# EAGLE design EXM Relay Four - Rev A1 (EAGLE 7.7.0)
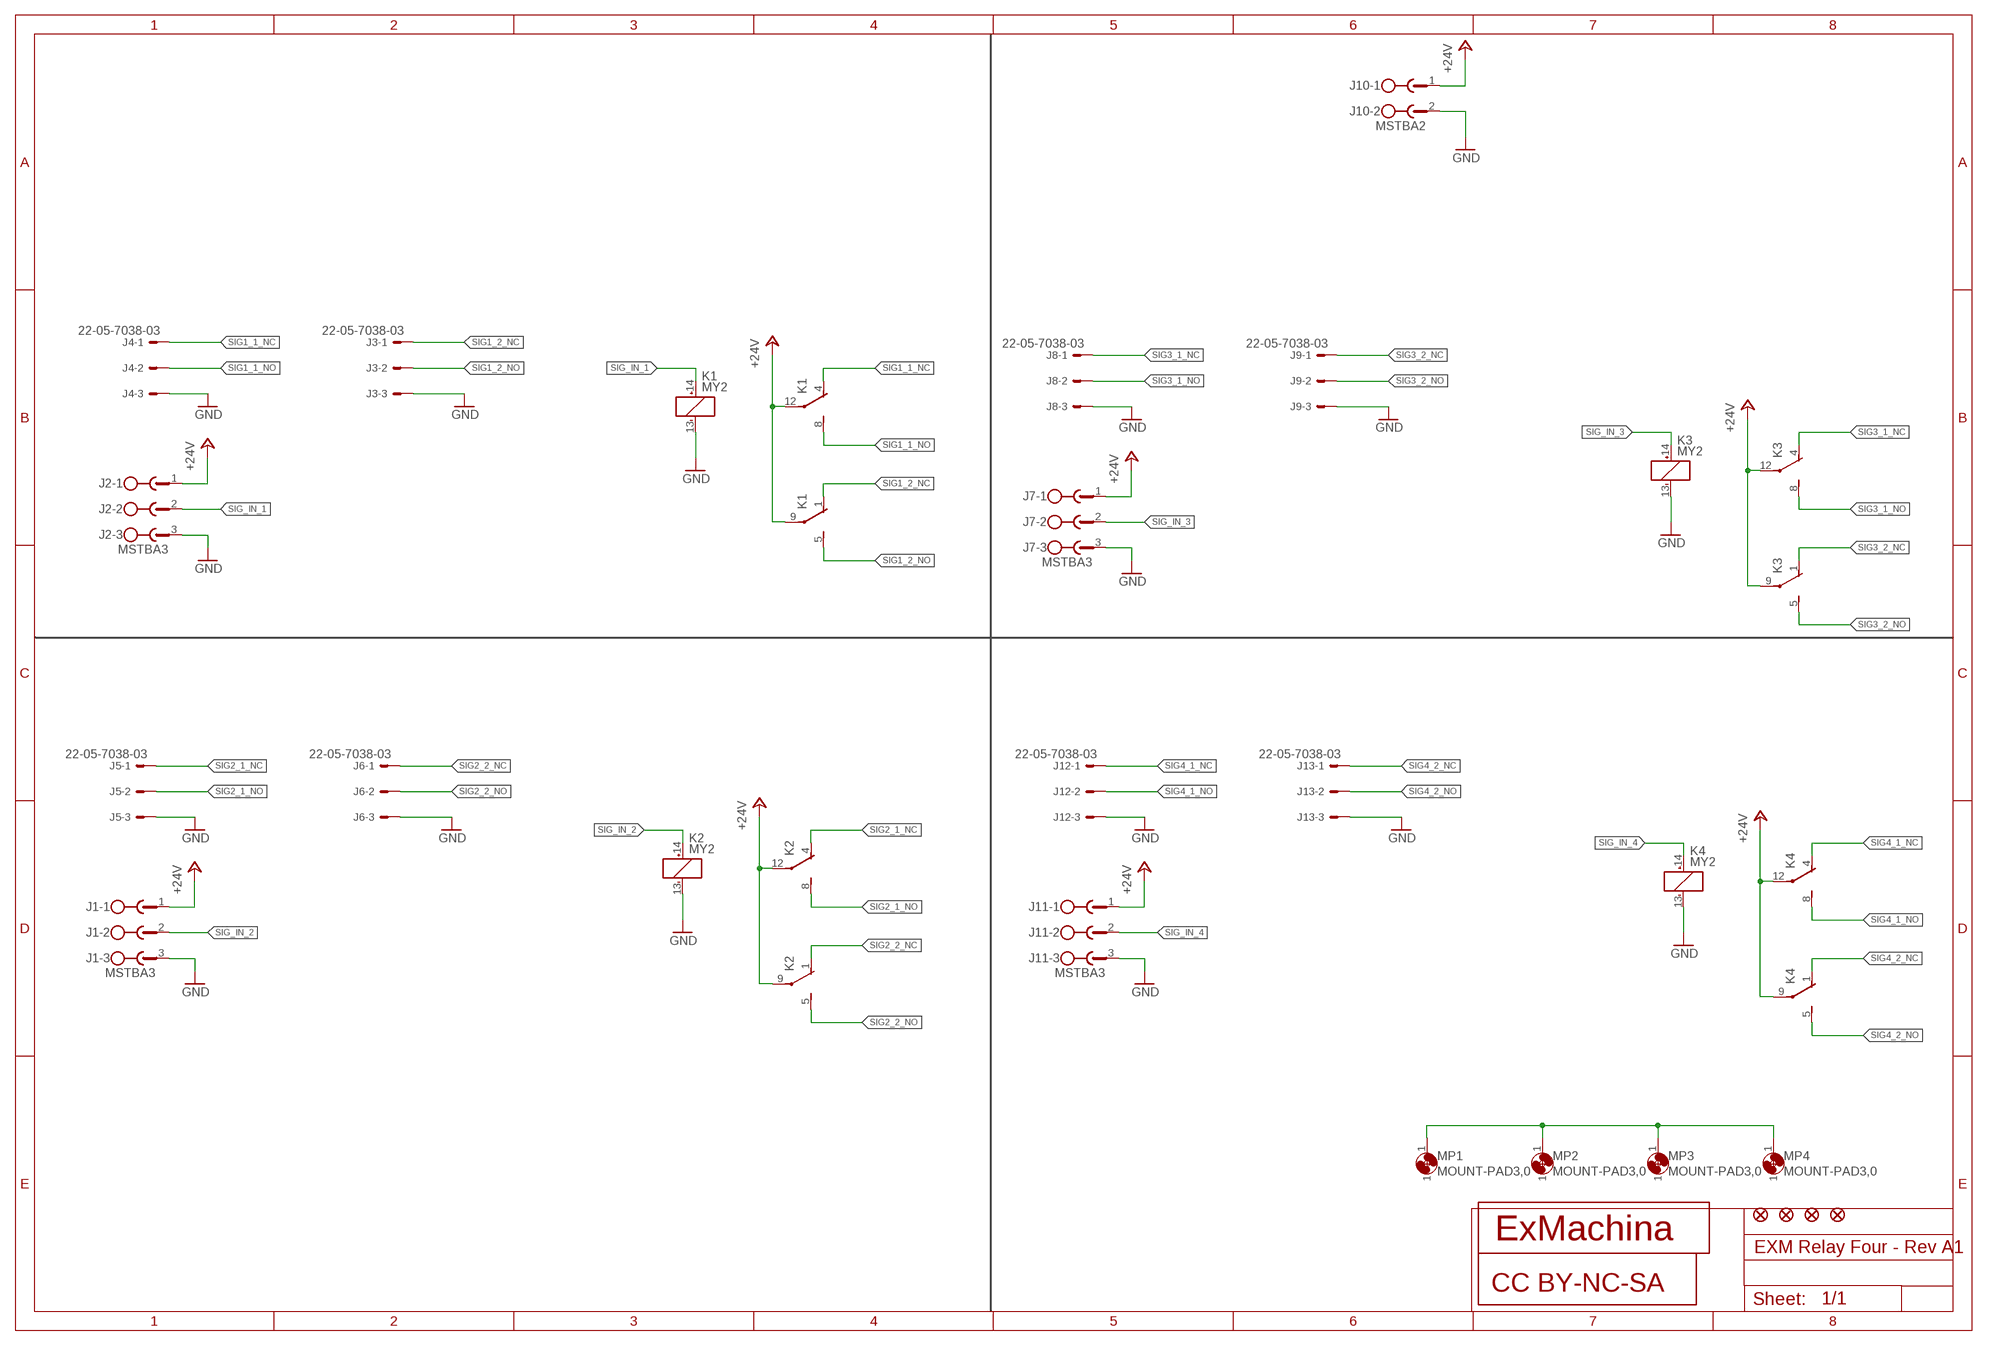
[diagram p0: schematic, sheet 1]

## Parts
CC1  CC-BY-NC-SA  [CC-BY-NC-SA]
J1  MSTBA3  [MSTBA3]
J2  MSTBA3  [MSTBA3]
J3  22-05-7038-03  [7395-03]
J4  22-05-7038-03  [7395-03]
J5  22-05-7038-03  [7395-03]
J6  22-05-7038-03  [7395-03]
J7  MSTBA3  [MSTBA3]
J8  22-05-7038-03  [7395-03]
J9  22-05-7038-03  [7395-03]
J10  MSTBA2  [MSTBA2]
J11  MSTBA3  [MSTBA3]
J12  22-05-7038-03  [7395-03]
J13  22-05-7038-03  [7395-03]
JP1  FIDUCIAL1X2  [FIDUCIAL-1X2]
JP2  FIDUCIAL1X2  [FIDUCIAL-1X2]
JP3  FIDUCIAL1X2  [FIDUCIAL-1X2]
JP4  FIDUCIAL1X2  [FIDUCIAL-1X2]
K1  MY2  [PY08]
K2  MY2  [PY08]
K3  MY2  [PY08]
K4  MY2  [PY08]
MP1  MOUNT-PAD3,0  [P3,0]
MP2  MOUNT-PAD3,0  [P3,0]
MP3  MOUNT-PAD3,0  [P3,0]
MP4  MOUNT-PAD3,0  [P3,0]
T1  EXMACHINA-LOGO-NAME  [EXM-LOGO-BASELINE]

## Nets
1: MP1.1 MP2.1 MP3.1 MP4.1
+24V: J1.1 J2.1 J7.1 J10.1 J11.1 K1.9(C) K1.12(C) K2.9(C) K2.12(C) K3.9(C) K3.12(C) K4.9(C) K4.12(C)
GND: J1.3 J2.3 J3.3 J4.3 J5.3 J6.3 J7.3 J8.3 J9.3 J10.2 J11.3 J12.3 J13.3 K1.13(-) K2.13(-) K3.13(-) K4.13(-)
SIG1_1_NC: J4.1 K1.4(NC)
SIG1_1_NO: J4.2 K1.8(NO)
SIG1_2_NC: J3.1 K1.1(NC)
SIG1_2_NO: J3.2 K1.5(NO)
SIG2_1_NC: J5.1 K2.4(NC)
SIG2_1_NO: J5.2 K2.8(NO)
SIG2_2_NC: J6.1 K2.1(NC)
SIG2_2_NO: J6.2 K2.5(NO)
SIG3_1_NC: J8.1 K3.4(NC)
SIG3_1_NO: J8.2 K3.8(NO)
SIG3_2_NC: J9.1 K3.1(NC)
SIG3_2_NO: J9.2 K3.5(NO)
SIG4_1_NC: J12.1 K4.4(NC)
SIG4_1_NO: J12.2 K4.8(NO)
SIG4_2_NC: J13.1 K4.1(NC)
SIG4_2_NO: J13.2 K4.5(NO)
SIG_IN_1: J2.2 K1.14(+)
SIG_IN_2: J1.2 K2.14(+)
SIG_IN_3: J7.2 K3.14(+)
SIG_IN_4: J11.2 K4.14(+)

## Library data of the parts
CC1 = cc-by-sa:CC-BY-NC-SA
J1 J2 J7 J11 = con-phoenix-508:MSTBA3: PHOENIX; MF: FARNELL; MPN: 1757255; OC_FARNELL: 3705183; OC_NEWARK: 71C4162
J3-J6 J8 J9 J12 J13 = con-molex:22-?-03: CONNECTOR wire to board 2.54 mm (.1 inch) pitch header; OC_FARNELL: 9731610; OC_NEWARK: unknown
J10 = con-phoenix-508:MSTBA2: PHOENIX; MF: FARNELL; MPN: 1757242; OC_FARNELL: 3705171; OC_NEWARK: 71C4161
JP1-JP4 = SparkFun:FIDUCIAL: Fiducial Alignment Points Various fiducial points for machine vision alignment.
K1-K4 = rel-omron:MY2
MP1-MP4 = holes:MOUNT-PAD: MOUNTING HOLE with drill center marker
T1 = exmachina:EXMACHINA-LOGO

## Net classes
0 default: width 0.813 mm

## Board
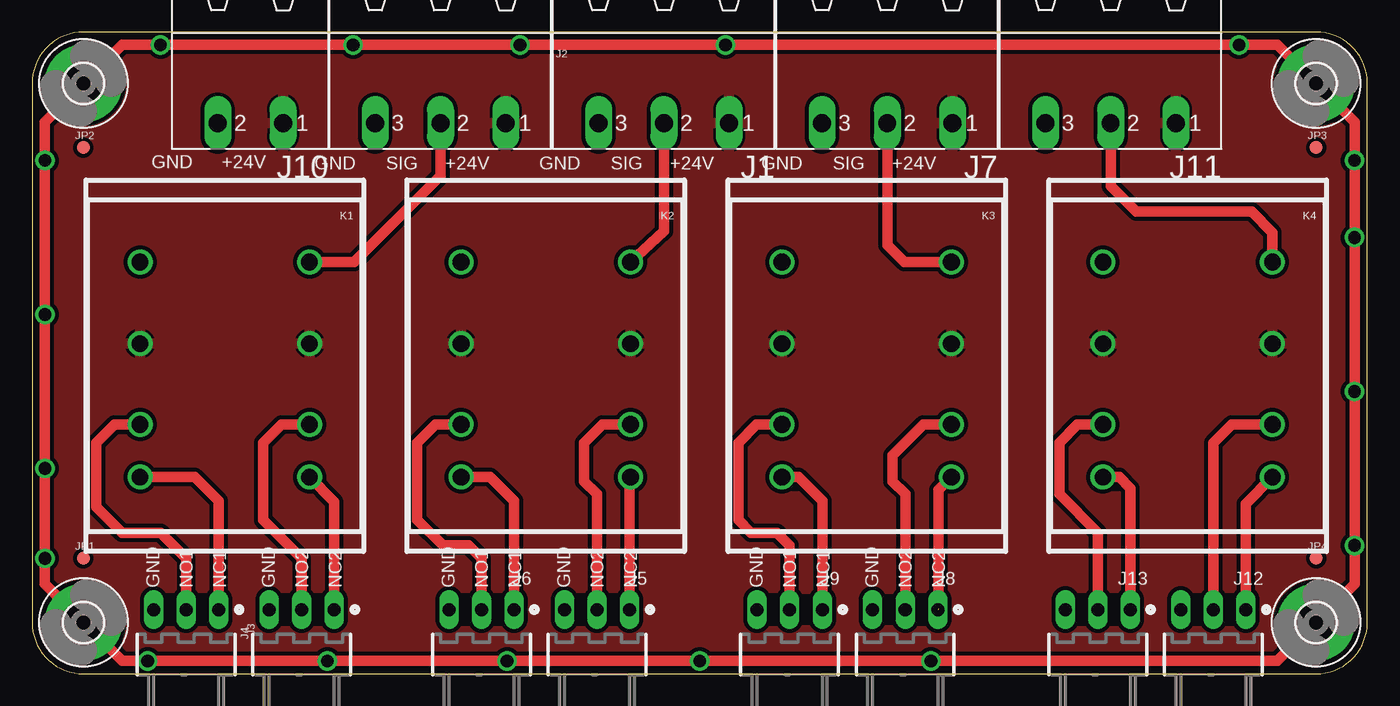
[diagram p1: board, top side]
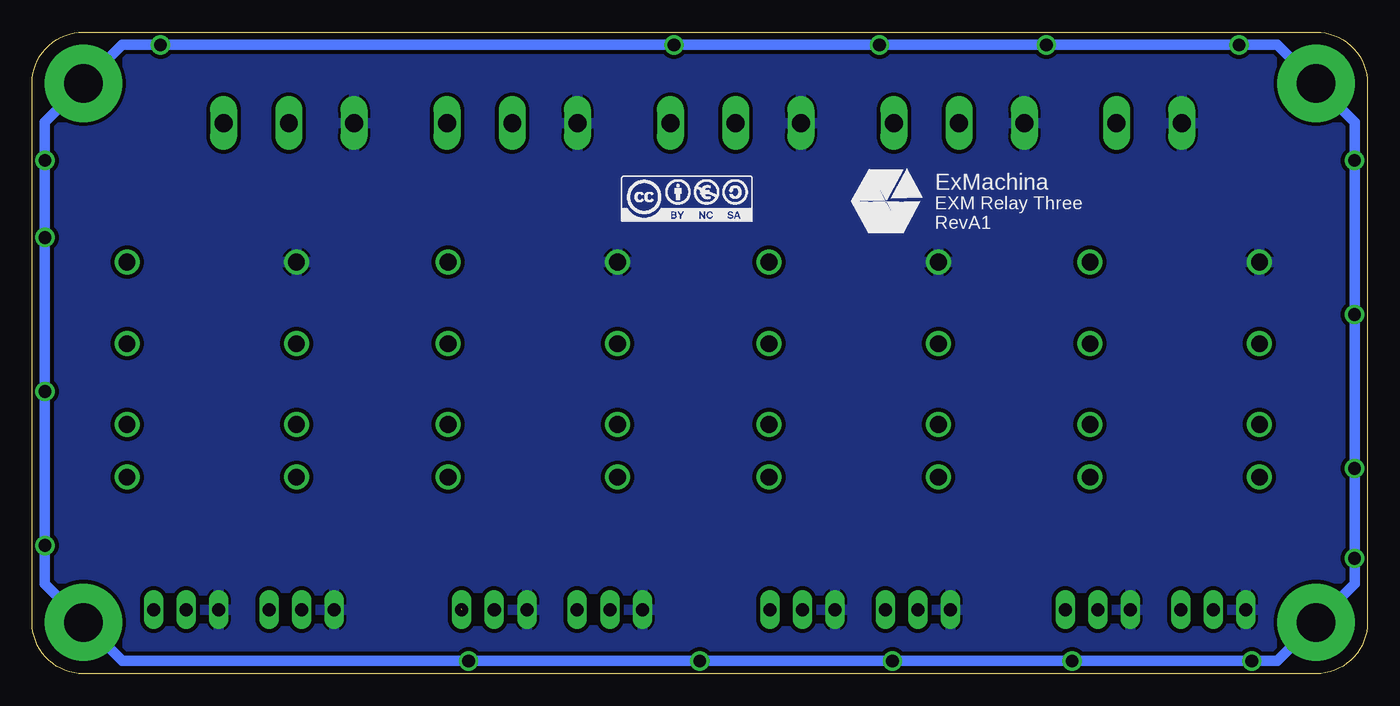
[diagram p2: board, bottom side, seen from below]

Size 104 x 50 mm. Coordinates in mm from the lower left corner, seen from the top.
Outline: 0,46 0,4 arc90 4,0 100,0 arc90 104,4 104,46 arc90 100,50 4,50 arc90 0,46
Copper layers (1*16): Top 0.105mm / dielectric 1.55mm / Bottom 0.105mm
Design rules "eC_2Layer_PClass3_BaseCopperO105": minimum track width 0.25mm, minimum drill 0.35mm, track to track 0.3mm, track to pad 0.3mm, pad to pad 0.3mm, via to via 0.3mm, smd to smd 0mil, copper to edge 0.25mm, drill to drill 0.35mm, minimum pad ring 0.25mm, minimum via ring 0.2mm, stop-mask expansion 0mil, vias tented up to drill 0.45mm, thermal gap 0.2mm

### Footprints (pad centres in the part's own frame; a part is rotated, then mirrored left to right if it is on the bottom)
MSTBA3 = drill 1.397 long: 1 -5.08,5.08; 2 0,5.08; 3 5.08,5.08
7395-03 = drill 1.016 long: 1 2.54,0; 2 0,0; 3 -2.54,0
MSTBA2 = drill 1.397 long: 1 -2.54,5.08; 2 2.54,5.08
FIDUCIAL-1X2 = smd 1 x 1: 1 0,0
PY08 = drill 1.3: 1 6.595,8.675; 4 -6.605,8.675; 5 6.595,4.575; 8 -6.605,4.575; 9 6.595,-1.725; 12 -6.605,-1.725; 13 6.595,-8.075; 14 -6.605,-8.075
P3,0 = drill 3 pad 6: 1 0,0

### Placement (x,y rotation side)
CC1  53,37 0 bottom
J1  49.2,48 180 top
J2  31.8,48 180 top
J3  12,5 0 top
J4  21,5 0 top
J5  44,5 0 top
J6  35,5 0 top
J7  66.6,48 180 top
J8  68,5 0 top
J9  59,5 0 top
J10  17,48 180 top
J11  84,48 180 top
J12  92,5 0 top
J13  83,5 0 top
JP1  4,9 0 top
JP2  4,41 0 top
JP3  100,41 0 top
JP4  100,9 0 top
K1  15,24 180 top
K2  40,24 180 top
K3  65,24 180 top
K4  90,24 180 top
MP1  100,4 0 top
MP2  4,46 0 top
MP3  100,46 0 top
MP4  4,4 0 top
T1  37.5,36.8 0 bottom
U$1  [A4L-LOC]  -87,-63 0 top  (outside the outline)

### Tracks (layer width: path | path; a pad name or v marks a point on that pad's centre or on a via)
1  (via drill 1)
  Top 0.813: 1,43 v1,40 v1,28 v1,16 v1,9 1,7 MP4.1 7,1 v9,1 v23,1 v37,1 v52,1 v70,1 97,1 MP1.1 103,7 v103,10 v103,22 v103,34 v103,40 103,43 MP3.1 97,49 v94,49 v54,49 v38,49 v25,49 v10,49 7,49 MP2.1 1,43
  Bottom 0.813: 1,43 v1,40 v1,28 v1,16 v1,9 1,7 MP4.1 7,1 v9,1 v23,1 v37,1 v52,1 v70,1 97,1 MP1.1 103,7 v103,10 v103,22 v103,34 v103,40 103,43 MP3.1 97,49 v94,49 v54,49 v38,49 v25,49 v10,49 7,49 MP2.1 1,43
+24V
  pour Top (isolate 0.305): 109,-9 -17,-9 -17,57 109,57
GND
  pour Bottom (isolate 0.305): 107,-7 -15,-7 -15,56 107,56
SIG1_1_NC
  Top 0.813: J4.1 23.54,13.39 K1.4
SIG1_1_NO
  Top 0.813: J4.2 21,9 18,12 18,18 19.43,19.43 K1.8
SIG1_2_NC
  Top 0.813: K1.1 12.68,15.32 14.54,13.46 J3.1
SIG1_2_NO
  Top 0.813: J3.2 12,9 10,11 7,11 5,13 5,18 6.42,19.43 K1.5
SIG2_1_NC
  Top 0.813: K2.4 46.54,15.26 J5.1
SIG2_1_NO
  Top 0.813: J5.2 44,14 43,15 43,18 44.42,19.43 K2.8
SIG2_2_NC
  Top 0.813: J6.1 37.54,13.46 35.67,15.32 K2.1
SIG2_2_NO
  Top 0.813: K2.5 31.43,19.43 30,18 30,12 32,10 34,10 35,9 J6.2
SIG3_1_NC  (1 unrouted)
  Top 0.813: 70.61,5.07 70.61,14.32 K3.4
SIG3_1_NO
  Top 0.813: J8.2 68,14 67,15 67,17 69.42,19.43 K3.8
SIG3_2_NC
  Top 0.813: J9.1 61.54,13.46 59.67,15.32 K3.1
SIG3_2_NO
  Top 0.813: J9.2 59,10 58,11 56,11 55,12 55,18 56.42,19.43 K3.5
SIG4_1_NC
  Top 0.813: J12.1 94.54,13.26 K4.4
SIG4_1_NO
  Top 0.813: K4.8 93.42,19.43 92,18 J12.2
SIG4_2_NC
  Top 0.813: K4.1 84.67,15.32 85.54,14.46 J13.1
SIG4_2_NO
  Top 0.813: J13.2 83,11 80,14 80,18 81.42,19.43 K4.5
SIG_IN_1
  Top 0.813: K1.14 25.07,32.08 31.8,38.8 J2.2
SIG_IN_2
  Top 0.813: K2.14 49.2,34.48 J1.2
SIG_IN_3
  Top 0.813: K3.14 67.92,32.08 66.6,33.4 J7.2
SIG_IN_4
  Top 0.813: K4.14 96.61,34.4 95,36 86,36 84,38 J11.2

### Text on the board
tPlace: GND | +24V | GND | SIG | +24V | GND | SIG | +24V | GND | SIG | +24V | GND | NO1 | NC1 | GND | NO2 | NC2 | GND | NO1 | NC1 | GND | NO2 | NC2 | GND | NO1 | NC1 | GND | NO2 | NC2
bPlace: EXM Relay Three / RevA1